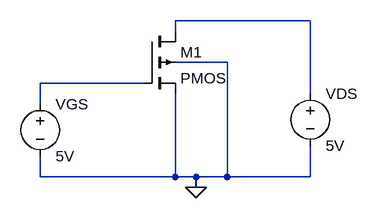
[diagram p0: schematic Draft1.asc]
Draft1.asc, the LTspice schematic file:
Version 4
SHEET 1 880 680
WIRE 416 64 208 64
WIRE 208 80 208 64
WIRE 288 128 208 128
WIRE 160 160 0 160
WIRE 416 176 416 64
WIRE 0 192 0 160
WIRE 0 304 0 272
WIRE 208 304 208 176
WIRE 208 304 0 304
WIRE 240 304 208 304
WIRE 288 304 288 128
WIRE 288 304 240 304
WIRE 416 304 416 256
WIRE 416 304 288 304
WIRE 240 320 240 304
FLAG 240 320 0
SYMBOL pmos4 160 80 R0
SYMATTR InstName M1
SYMBOL voltage 416 160 R0
WINDOW 123 0 0 Left 0
WINDOW 39 0 0 Left 0
SYMATTR InstName VDS
SYMATTR Value 5V
SYMBOL voltage 0 176 R0
SYMATTR InstName VGS
SYMATTR Value 5V

The netlist it stands for:
* Draft1.asc
M1 N001 N002 0 0 PMOS
VDS N001 0 5V
VGS N002 0 5V
.model NMOS NMOS
.model PMOS PMOS
.lib standard.mos
.backanno
.end